# Altium schematic sheet Thread_Interrupts.SchDoc
size A
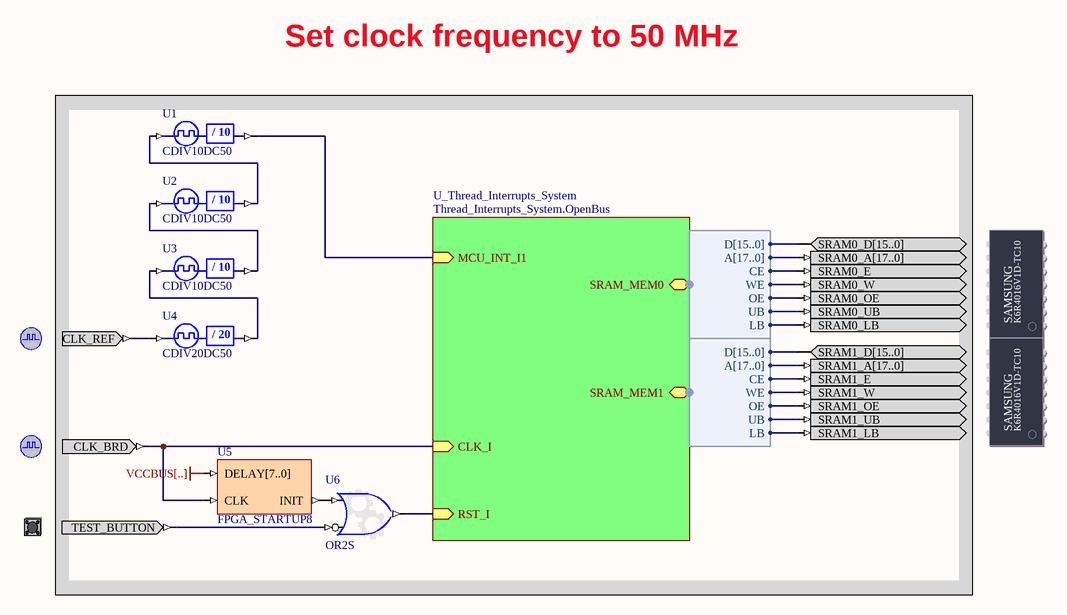
[diagram p0: Thread_Interrupts.SchDoc]

## Parts
(Parts that share a designator on the sheet are numbered #1, #2 ... from top to bottom, then left to right.)
?#1  SRAM_DAUGHTER0  (value not drawn)
?#2  CLOCK_REFERENCE  (value not drawn)
?#3  SRAM_DAUGHTER1  (value not drawn)
?#4  CLOCK_BOARD  (value not drawn)
?#5  TEST_BUTTON  (value not drawn)
U1  CDIV10DC50
U2  CDIV10DC50
U3  CDIV10DC50
U4  CDIV20DC50
U5  FPGA_STARTUP8
U6  OR2S

## Sub-sheets
U_Thread_Interrupts_System = Thread_Interrupts_System.OpenBus: CLK_I (in), RST_I (in), SRAM_MEM0 (harness WB_MEM_CTRL_SRAM16_A18), SRAM_MEM1 (harness WB_MEM_CTRL_SRAM16_A18), MCU_INT_I1 (in)

## Harnesses
WB_MEM_CTRL_SRAM16_A18: D[15..0], A[17..0], CE, WE, OE, UB, LB

## Nets
VCCBUS[..]: U5.DELAY[7..0]
Net?#1_SRAM0_A[17..0]: ?#1.SRAM0_A[17..0] ; sheet U_Thread_Interrupts_System/SRAM_MEM0.A[17..0]
Net?#1_SRAM0_D[15..0]: ?#1.SRAM0_D[15..0] ; sheet U_Thread_Interrupts_System/SRAM_MEM0.D[15..0]
Net?#1_SRAM0_E: ?#1.SRAM0_E ; sheet U_Thread_Interrupts_System/SRAM_MEM0.CE
Net?#1_SRAM0_LB: ?#1.SRAM0_LB ; sheet U_Thread_Interrupts_System/SRAM_MEM0.LB
Net?#1_SRAM0_OE: ?#1.SRAM0_OE ; sheet U_Thread_Interrupts_System/SRAM_MEM0.OE
Net?#1_SRAM0_UB: ?#1.SRAM0_UB ; sheet U_Thread_Interrupts_System/SRAM_MEM0.UB
Net?#1_SRAM0_W: ?#1.SRAM0_W ; sheet U_Thread_Interrupts_System/SRAM_MEM0.WE
Net?#2_CLK_REF: ?#2.CLK_REF U4.CLKIN
Net?#3_SRAM1_A[17..0]: ?#3.SRAM1_A[17..0] ; sheet U_Thread_Interrupts_System/SRAM_MEM1.A[17..0]
Net?#3_SRAM1_D[15..0]: ?#3.SRAM1_D[15..0] ; sheet U_Thread_Interrupts_System/SRAM_MEM1.D[15..0]
Net?#3_SRAM1_E: ?#3.SRAM1_E ; sheet U_Thread_Interrupts_System/SRAM_MEM1.CE
Net?#3_SRAM1_LB: ?#3.SRAM1_LB ; sheet U_Thread_Interrupts_System/SRAM_MEM1.LB
Net?#3_SRAM1_OE: ?#3.SRAM1_OE ; sheet U_Thread_Interrupts_System/SRAM_MEM1.OE
Net?#3_SRAM1_UB: ?#3.SRAM1_UB ; sheet U_Thread_Interrupts_System/SRAM_MEM1.UB
Net?#3_SRAM1_W: ?#3.SRAM1_W ; sheet U_Thread_Interrupts_System/SRAM_MEM1.WE
Net?#4_CLK_BRD: ?#4.CLK_BRD U5.CLK ; sheet U_Thread_Interrupts_System/CLK_I
Net?#5_TEST_BUTTON: ?#5.TEST_BUTTON U6.I1
NetU1_CLKDV: U1.CLKDV ; sheet U_Thread_Interrupts_System/MCU_INT_I1
NetU1_CLKIN: U1.CLKIN U2.CLKDV
NetU2_CLKIN: U2.CLKIN U3.CLKDV
NetU3_CLKIN: U3.CLKIN U4.CLKDV
NetU5_INIT: U5.INIT U6.I0
NetU6_O: U6.O ; sheet U_Thread_Interrupts_System/RST_I

## Notes on the sheet
- Set clock frequency to 50 MHz
- Title
- Size:
- Date:
- A
- Number:
- Time:
- Revision:
- Sheet
- of
- File:
- (in symbol CDIV10DC50) / 10
- (in symbol CDIV20DC50) / 20
- (in symbol SRAM_DAUGHTER0) SAMSUNG; K6R4016V1D-TC10
- (in symbol SRAM_DAUGHTER1) SAMSUNG; K6R4016V1D-TC10

## Library data of the parts
?#1 = SRAM_DAUGHTER0: Free Static RAM - Daughterboard; PortComponent: True; Published: 14-May-2007; Publisher: Altium Limited; HelpURL: TR0143 NanoBoard Technical Reference Manual - NB2.pdf#page=24
?#2 = CLOCK_REFERENCE: Global System Clock Reference Supply; PortComponent: True; Published: 19-Nov-2003; Publisher: Altium Limited; HelpURL: TR0102 NanoBoard Technical Reference Manual - NB1.pdf#page=29
?#3 = SRAM_DAUGHTER1: Free Static RAM - Daughterboard; PortComponent: True; Published: 14-May-2007; Publisher: Altium Limited; HelpURL: TR0143 NanoBoard Technical Reference Manual - NB2.pdf#page=24
?#4 = CLOCK_BOARD: Global System Clock Supply; PortComponent: True; Published: 19-Nov-2003; Publisher: Altium Limited; HelpURL: TR0143 Technical Reference Manual for Altium's Desktop NanoBoard NB2DSK01.pdf#page=41; UseInDSF: True
?#5 = TEST_BUTTON: Test / Reset Button; PortComponent: True; Published: 19-Nov-2003; Publisher: Altium Limited; HelpURL: TR0143 Technical Reference Manual for Altium's Desktop NanoBoard NB2DSK01.pdf#page=53
U1-U3 = CDIV10DC50: Clock Divider by 10 with 50% Duty Cycle Output; XilinxEquivalent: CLK_DIV10; DivisorRate: 10; DutyCycle: 50; ArchiveName: GENERIC; VHDLIB_SIM: GENERIC_LIB; Published: 29-Jan-2004; Publisher: Altium Limited; LastRevisionNo: 1.00.00; HelpURL: CR0118 FPGA Generic Library Guide.pdf#page=143; ComponentLink1URL: CR0127 FPGA Clock Divider Resource Usage.pdf#page=15; ComponentLink1Description: Core &Resource Usage; FunctionalClass: Clock Divider
U4 = CDIV20DC50: Clock Divider by 20 with 50% Duty Cycle Output; DivisorRate: 20; DutyCycle: 50; ArchiveName: GENERIC; VHDLIB_SIM: GENERIC_LIB; Published: 29-Jan-2004; Publisher: Altium Limited; LastRevisionNo: 1.00.00; HelpURL: CR0118 FPGA Generic Library Guide.pdf#page=142; ComponentLink1URL: CR0127 FPGA Clock Divider Resource Usage.pdf#page=21; ComponentLink1Description: Core &Resource Usage; FunctionalClass: Clock Divider
U5 = FPGA_STARTUP8: FPGA Startup With 8 Bit Delay; Published: 9-Dec-2004; Publisher: Altium Limited; HelpURL: CR0119 FPGA_STARTUPx Powerup Delay Unit.pdf; LastRevisionNo: 1.00.00; ComponentLink1Description: Core &Resource Usage; ComponentLink1URL: CR0139 FPGA Peripheral Resource Usage.pdf#page=11
U6 = GATE: Configurable Generic Gate; ConfiguratorName: GENERIC_GATE; ConfigurationParameters: {}Version[1.0]{}GateKind[OR]{}BusInput[False]{}GateInputType[Bit]{}GateOutputOption[Normal]{}BusWidth[8]{}RegisterOutputs[False]{}NegativeClockEdge[False]{}InputCount[2]{}InputInvert0[False]{}InputInvert1[True]{}; LastRevisionNo: 1.00.00; Published: 3-Sep-2008; Publisher: Altium Limited